# EAGLE design Zavrsni Rad (EAGLE 8.3.2)
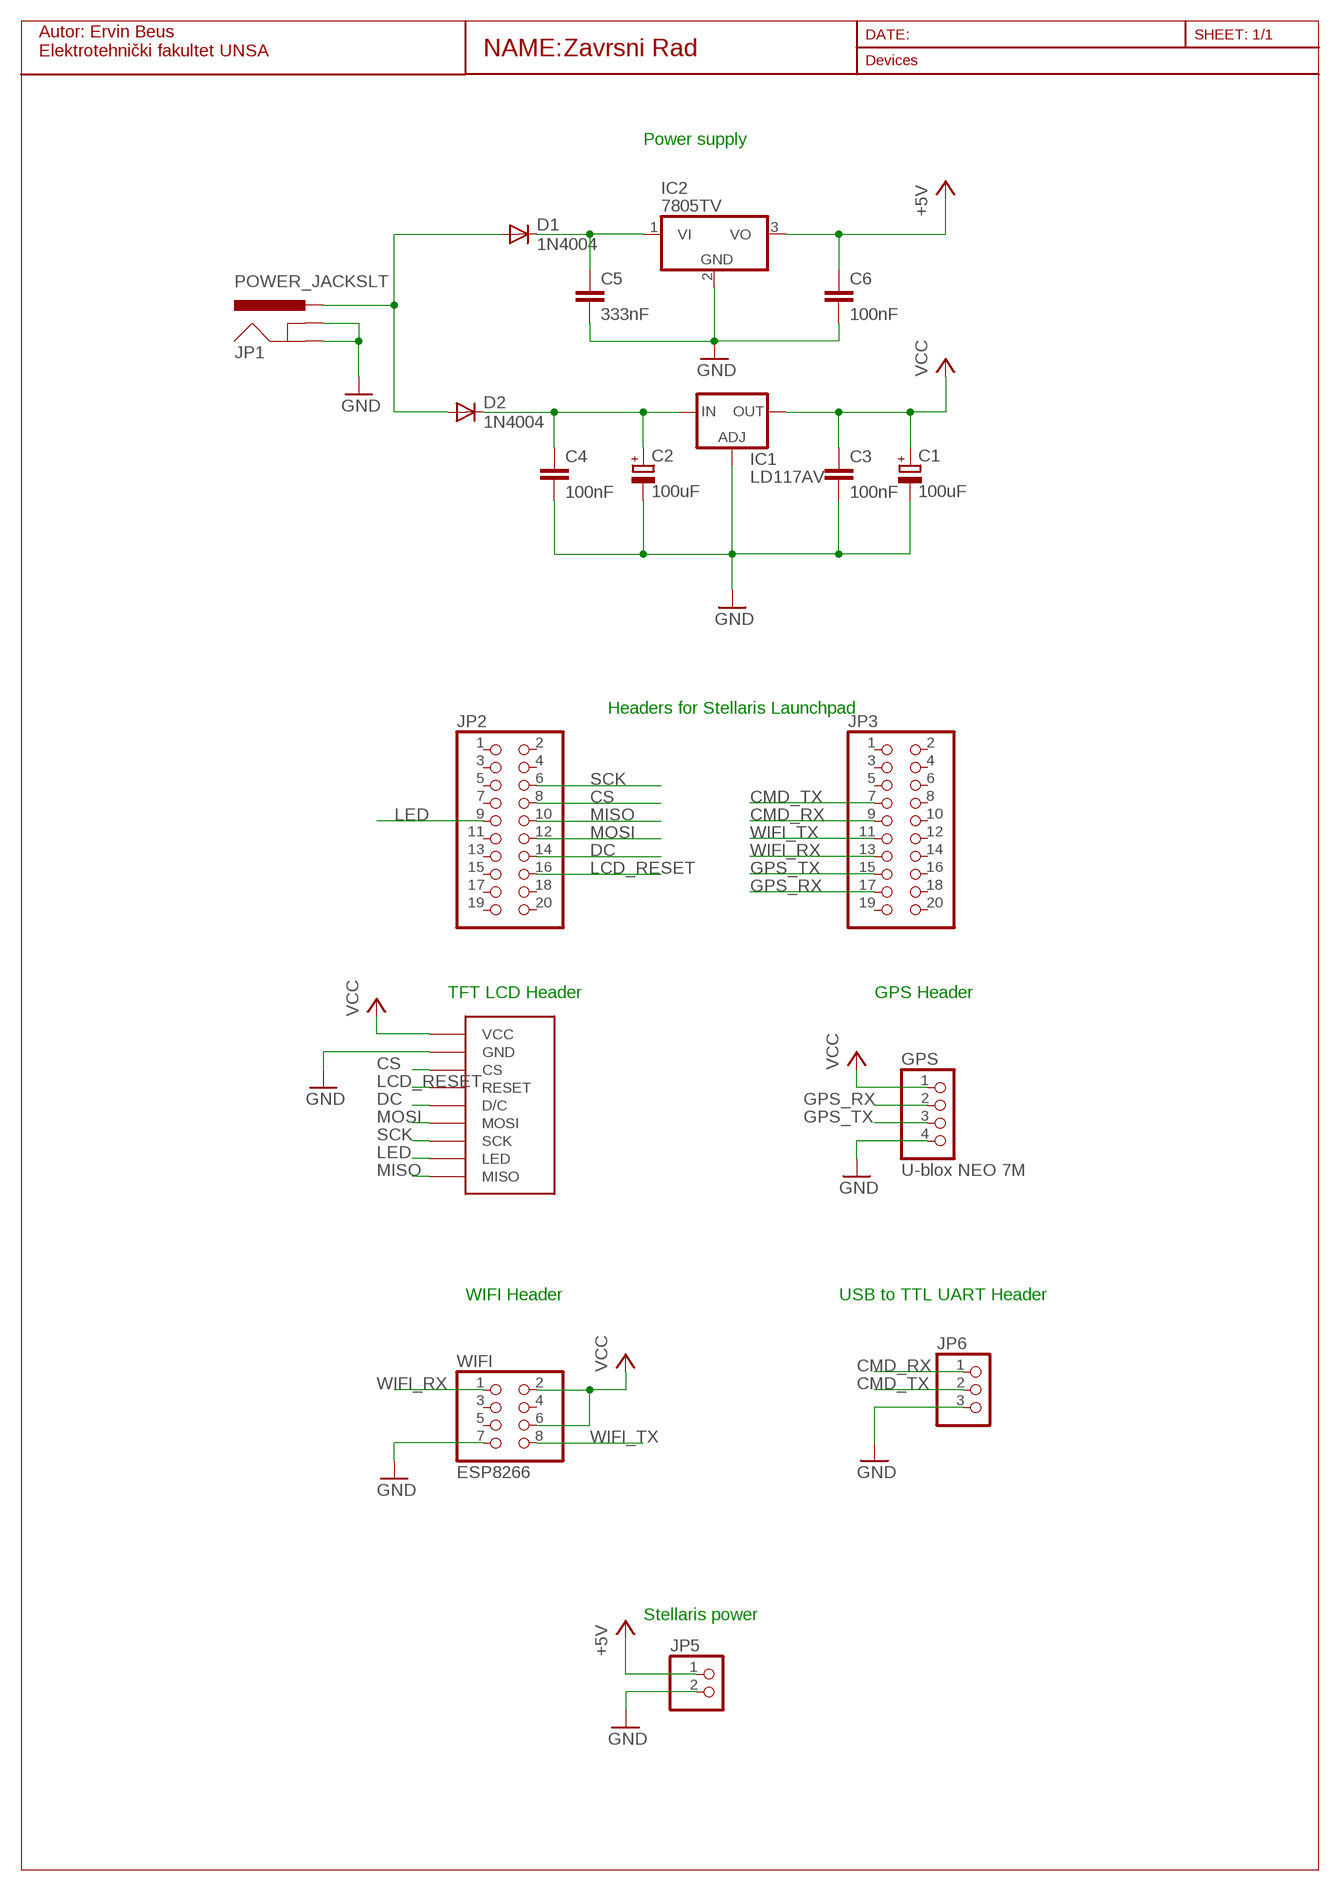
[diagram p0: schematic, sheet 1]

## Parts
C1  100uF  CPOL-EUE2,5-6E  [E2,5-6E]
C2  100uF  CPOL-EUE2,5-6E  [E2,5-6E]
C3  100nF  C-EU025-024X044  [C025-024X044]
C4  100nF  C-EU025-024X044  [C025-024X044]
C5  333nF  C-EU025-024X044  [C025-024X044]
C6  100nF  C-EU025-024X044  [C025-024X044]
D1  1N4004  [DO41-10]
D2  1N4004  [DO41-10]
GPS  U-blox NEO 7M  PINHD-1X4  [1X04]
IC1  LD117AV  [TO220L1]
IC2  7805TV  [TO220V]
JP1  POWER_JACKSLT  [POWER_JACK_SLOT]
JP2  PINHD-2X10  [2X10]
JP3  PINHD-2X10  [2X10]
JP5  PINHD-1X2  [1X02]
JP6  PINHD-1X3  [1X03]
TFTLCD  SPI_TFT_DISPLAY  [SPI_DISPLAY]
WIFI  ESP8266  PINHD-2X4  [2X04]

## Nets
+5V [pwr]: C6.1 IC2.3(VO) JP5.1
CMD_RX: JP3.9 JP6.1
CMD_TX: JP3.7 JP6.2
CS: JP2.8 TFTLCD.CS
DC: JP2.14 TFTLCD.D/C
GND: C1.- C2.- C3.2 C4.2 C5.2 C6.2 GPS.4 IC1.1(ADJ) IC2.2(GND) JP1.GND@1(GNDBREAK) JP1.GND@2(GND) JP5.2 JP6.3 TFTLCD.GND WIFI.7
GPS_RX: GPS.2 JP3.17
GPS_TX: GPS.3 JP3.15
LCD_RESET [del]: JP2.16 TFTLCD.RESET
LED [del]: JP2.9 TFTLCD.LED
MISO: JP2.10 TFTLCD.MISO
MOSI: JP2.12 TFTLCD.MOSI
N$1 [pwr]: C5.1 D1.C IC2.1(VI)
N$4 [pwr]: D1.A D2.A JP1.PWR
N$11 [pwr]: C2.+ C4.1 D2.C IC1.3(IN)
SCK: JP2.6 TFTLCD.SCK
VCC [pwr]: C1.+ C3.1 GPS.1 IC1.2(OUT) TFTLCD.VCC WIFI.2 WIFI.6
WIFI_RX: JP3.13 WIFI.1
WIFI_TX: JP3.11 WIFI.8
Unconnected: JP2.1 JP2.2 JP2.3 JP2.4 JP2.5 JP2.7 JP2.11 JP2.13 JP2.15 JP2.17 JP2.18 JP2.19 JP2.20 JP3.1 JP3.2 JP3.3 JP3.4 JP3.5 JP3.6 JP3.8 JP3.10 JP3.12 JP3.14 JP3.16 JP3.18 JP3.19 JP3.20 WIFI.3 WIFI.4 WIFI.5

## Notes on the sheet
- Autor: Ervin Beus
  Elektrotehnički fakultet UNSA
- Power supply
- Headers for Stellaris Launchpad
- TFT LCD Header | GPS Header
- WIFI Header | USB to TTL UART Header
- Stellaris power

## Library data of the parts
C1 C2 = rcl:CPOL-EU: POLARIZED CAPACITOR, European symbol
C3-C6 = rcl:C-EU: CAPACITOR, European symbol
D1 D2 = diode:1N4004: DIODE general purpose rectifier, 1 A
GPS = pinhead:PINHD-1X4: PIN HEADER
IC1 = v-reg:LD117A?*: Low drop fixed and adjustable positive voltage regulators 1 A Source: http://www.st.com/stonline/products/literature/ds/7194/ld1117axx.pdf
IC2 = linear:78*: Positive VOLTAGE REGULATOR Source: http://cache.national.com/ds/LM/LM78L05.pdf http://www.fairchildsemi.com/ds/LM/LM7805.pdf
JP1 = kanflo:POWER_JACK: Power Jack This is the standard 5.5mm barrel jack for power. The SLT footprint has been proven in designs produced by DirtyPCBs.com and only works if the mill layer is transmitted to the PCB fab house and the fab house accepts it. Rumours has it OSH Park accepts this design too. This symbol is meant for the cheap PCB mount connectors you find on eBay, retailing at less than 2EUR/10pcs (search for "dc power jack 5.5 2.1 pcb"). The difference between these and the ones sold by eg. SparkFun is the location of the pads relative to the plastic body.
JP2 JP3 = pinhead:PINHD-2X10: PIN HEADER
JP5 = pinhead:PINHD-1X2: PIN HEADER
JP6 = pinhead:PINHD-1X3: PIN HEADER
TFTLCD = kanflo:SPI_TFT_DISPLAY: SPI TFT Display Connector for the cheap 2.2"/2.4" Serial SPI TFT displays found on eBay.
WIFI = pinhead:PINHD-2X4: PIN HEADER

## Net classes
0 default: width 0.381 mm, drill 0.508 mm, clearance 0.305 mm
1 pwr: width 1.016 mm, drill 0.508 mm, clearance 0.762 mm
2 del: width 2.54 mm, drill 0.508 mm, clearance 0.508 mm to class 0

## Board
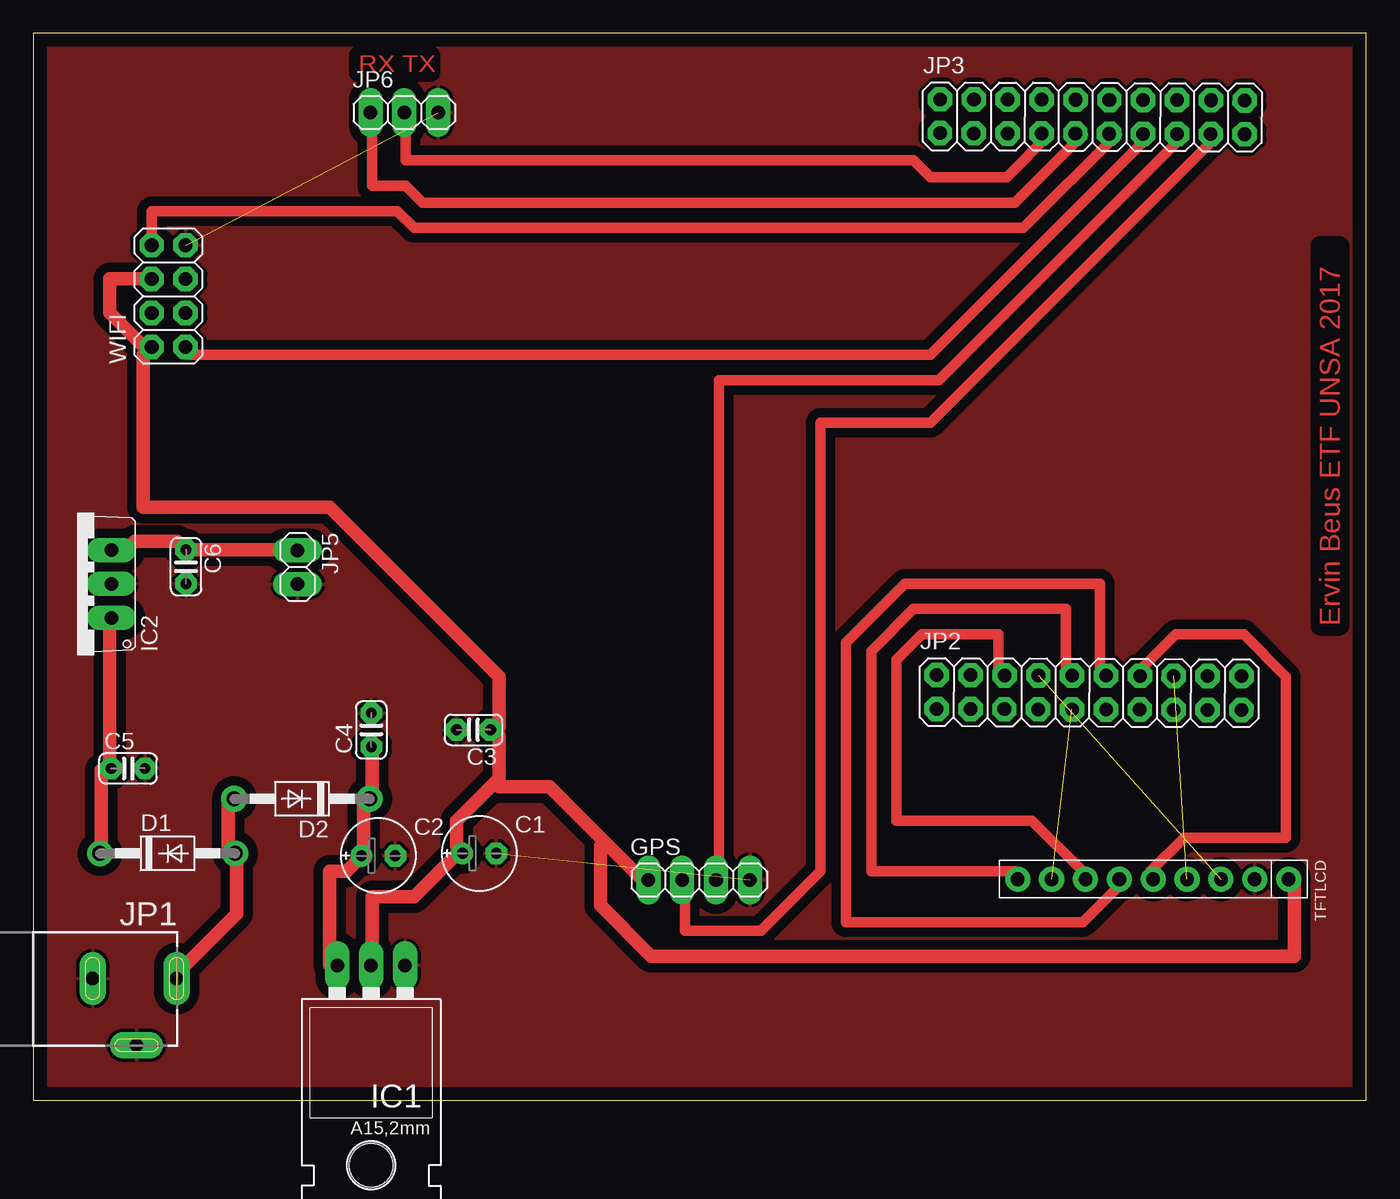
[diagram p1: board, top side]

Size 100 x 80 mm. Coordinates in mm from the lower left corner, seen from the top.
Outline: 0,0 100,0 100,80 0,80 0,0
Copper layers (1*16): Top 0.035mm / dielectric 1.5mm / Bottom 0.035mm
Design rules "default *": minimum track width 0.8mm, minimum drill 0.8mm, track to track 28mil, track to pad 25mil, pad to pad 2mil, via to via 20mil, smd to smd 6mil, copper to edge 40mil, drill to drill 6mil, minimum pad ring 16mil, minimum via ring 8mil, stop-mask expansion 4mil, vias tented up to drill 0mil, thermal gap 10mil

### Footprints (pad centres in the part's own frame; a part is rotated, then mirrored left to right if it is on the bottom)
E2,5-6E = drill 0.813 pad 1.575: + -1.27,0 | drill 0.813 pad 1.575 octagon: - 1.27,0
C025-024X044 = drill 0.813 octagon: 1 -1.27,0; 2 1.27,0
DO41-10 = drill 1.118: A 5.08,0; C -5.08,0
1X04 = drill 1.016 long: 1 -3.81,0; 2 -1.27,0; 3 1.27,0; 4 3.81,0
TO220L1 = drill 1.016 long: 1 -2.54,-3.81; 2 0,-3.81; 3 2.54,-3.81 | hole 3.302: 0,11.176
TO220V = drill 1.016 long: 1 -2.54,-2.54; 2 0,-2.54; 3 2.54,-2.54
POWER_JACK_SLOT = drill 1 pad 2 long: GND@1 2.5,1.39; GND@2 -2.5,-1.91; PWR 2.5,-4.91
2X10 = drill 1.016 octagon: 1 -11.43,-1.27; 2 -11.43,1.27; 3 -8.89,-1.27; 4 -8.89,1.27; 5 -6.35,-1.27; 6 -6.35,1.27; 7 -3.81,-1.27; 8 -3.81,1.27; 9 -1.27,-1.27; 10 -1.27,1.27; 11 1.27,-1.27; 12 1.27,1.27; 13 3.81,-1.27; 14 3.81,1.27; 15 6.35,-1.27; 16 6.35,1.27; 17 8.89,-1.27; 18 8.89,1.27; 19 11.43,-1.27; 20 11.43,1.27
1X02 = drill 1.016 long: 1 -1.27,0; 2 1.27,0
1X03 = drill 1.016 long: 1 -2.54,0; 2 0,0; 3 2.54,0
SPI_DISPLAY = drill 1.016 pad 1.88: CS -5.08,3.81; D/C -5.08,-1.27; GND -5.08,6.35; LED -5.08,-8.89; MISO -5.08,-11.43; MOSI -5.08,-3.81; RESET -5.08,1.27; SCK -5.08,-6.35; VCC -5.08,8.89
2X04 = drill 1.016 octagon: 1 -3.81,-1.27; 2 -3.81,1.27; 3 -1.27,-1.27; 4 -1.27,1.27; 5 1.27,-1.27; 6 1.27,1.27; 7 3.81,-1.27; 8 3.81,1.27

### Placement (x,y rotation side)
C1  33.46,18.5 0 top
C2  25.88,18.32 0 top
C3  33.03,27.76 180 top
C4  25.36,27.75 90 top
C5  7.11,24.87 0 top
C6  11.45,40 270 top
D1  10.07,18.5 0 top
D2  20.16,22.59 180 top
GPS  49.95,16.5 0 top
IC1  25.34,6.28 180 top
IC2  3.31,38.7 90 top
JP1  5.84,6.61 90 top
JP2  79.21,30.56 359.8 top
JP3  79.46,73.74 359.8 top
JP5  19.82,39.95 270 top
JP6  27.84,74.06 0 top
TFTLCD  85.29,11.48 270 top
WIFI  10.15,60.29 90 top

### Tracks (layer width: path | path; a pad name or v marks a point on that pad's centre or on a via)
+5V
  Top 1.016: IC2.3 6.35,41.27 6.99,41.27 7.62,41.91 10.79,41.91 11.43,41.27 C6.1 12.06,41.27 19.68,41.27 JP5.1
CMD_RX
  Top 0.8: JP6.1 25.4,73.66 25.4,68.58 27.94,68.58 29.21,67.31 73.66,67.31 78.74,72.39 JP3.9
CMD_TX
  Top 0.8: JP6.2 27.94,73.66 27.94,70.48 66.04,70.48 67.31,69.22 73.03,69.22 76.2,72.39 JP3.7
CS  (1 unrouted)
DC
  Top 0.8: JP2.14 83.19,32.38 85.72,34.92 90.81,34.92 93.98,31.75 93.98,19.68 86.36,19.68 83.82,17.14 TFTLCD.D/C
GND  (2 unrouted)
  pour Top: -4.42,84.38 107.13,84.38 107.36,84.6 107.36,-1.48 107.47,-1.59 -4.2,-1.59 -4.54,-1.93 -4.54,84.26
GPS_RX
  Top 0.8: GPS.2 48.9,15.88 48.9,12.7 54.61,12.7 59.05,17.14 59.05,50.8 67.31,50.8 88.9,72.39 JP3.17
GPS_TX
  Top 0.8: GPS.3 51.44,16.51 51.44,53.98 67.94,53.98 86.36,72.39 JP3.15
LCD_RESET  (1 unrouted)
LED  (1 unrouted)
MISO
  Top 0.8: JP2.10 77.47,32.38 77.47,36.83 66.04,36.83 62.87,33.66 62.87,17.14 73.66,17.14 TFTLCD.MISO
MOSI
  Top 0.8: JP2.12 80.01,32.38 80.01,38.73 65.41,38.73 60.96,34.29 60.96,13.34 78.74,13.34 81.92,16.51 TFTLCD.MOSI
N$1
  Top 1.016: IC2.1 5.71,35.56 5.71,25.4 C5.1 5.71,24.77 5.08,24.77 5.08,19.05 D1.C
N$4
  Top 1.016: D2.A 14.61,22.23 14.61,19.05 D1.A 15.24,18.41 15.24,13.97 10.79,9.53 JP1.PWR
N$11
  Top 1.016: C4.1 25.4,26.04 25.4,22.86 D2.C 24.77,22.23 24.77,18.41 C2.+ 24.13,17.78 23.5,17.14 22.23,17.14 22.23,10.16 IC1.3
SCK
  Top 0.8: JP2.6 72.39,32.38 72.39,34.92 66.67,34.92 64.77,33.02 64.77,20.95 74.93,20.95 78.74,17.14 TFTLCD.SCK
VCC
  Top 1.016: WIFI.6 8.26,61.59 5.71,61.59 5.71,59.05 8.26,56.52 WIFI.2 8.26,55.88 8.26,44.45 22.23,44.45 34.92,31.75 34.92,27.94 C3.1 34.92,27.3 34.92,24.13 34.61,23.81 | 34.61,23.81 31.75,20.95 31.75,19.05 C1.+ 31.75,18.41 28.57,15.24 25.4,15.24 25.4,10.16 IC1.2 | 42.86,19.37 38.73,23.5 34.92,23.5 34.61,23.81 | 42.86,19.37 45.72,16.51 GPS.1 | TFTLCD.VCC 94.61,16.51 94.61,10.79 46.35,10.79 42.55,14.61 42.55,19.05 42.86,19.37
WIFI_RX
  Top 0.8: WIFI.1 11.43,55.88 67.31,55.88 83.82,72.39 JP3.13
WIFI_TX
  Top 0.8: WIFI.8 8.89,64.14 8.89,66.67 27.3,66.67 28.57,65.41 74.3,65.41 81.28,72.39 JP3.11

### Text on the board
Top: RX TX | Ervin Beus ETF UNSA 2017